# Altium schematic sheet CPU_USB2_USB3_PHY.SchDoc
size A3; SheetNumber: 9; SheetTotal: 21
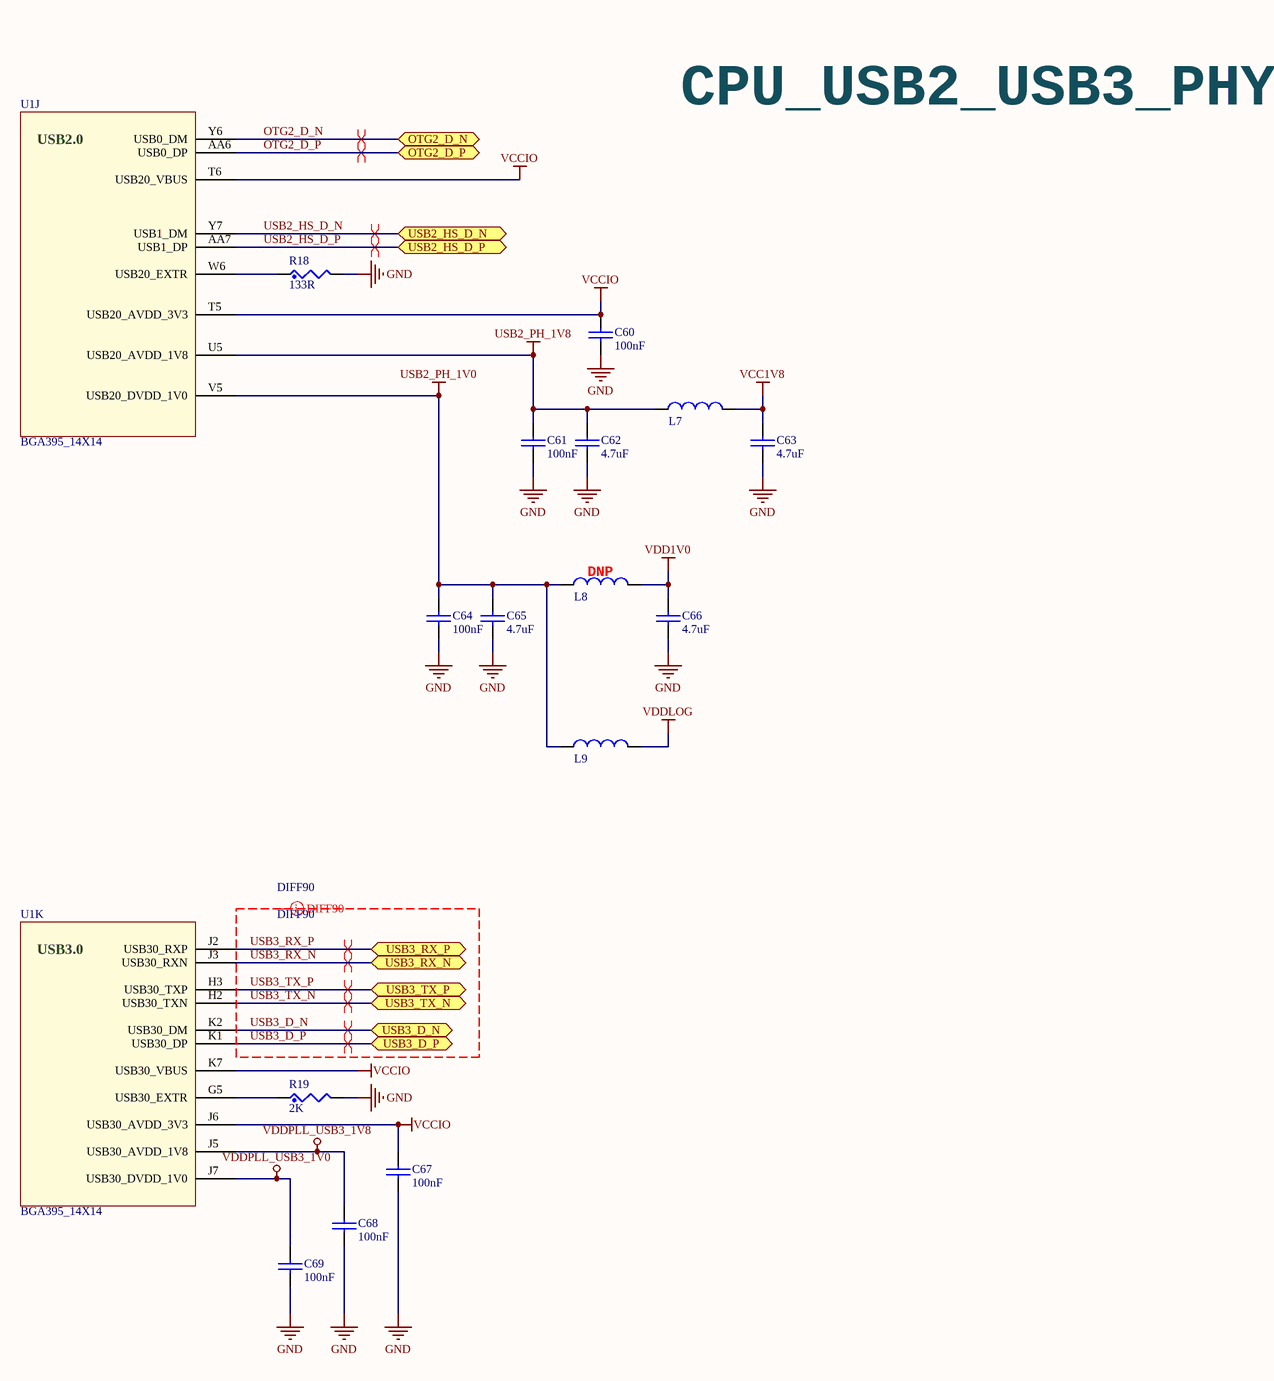
[diagram p0: CPU_USB2_USB3_PHY.SchDoc]

## Parts
C60  100nF  [0402_CC - C]
C61  100nF  [0402_CC - C]
C62  4.7uF  [0402_CC - C]
C63  4.7uF  [0402_CC - C]
C64  100nF  [0402_CC - C]
C65  4.7uF  [0402_CC - C]
C66  4.7uF  [0402_CC - C]
C67  100nF  [0402_CC - C]
C68  100nF  [0402_CC - C]
C69  100nF  [0402_CC - C]
L7  INDCHIP  [0603_C_Inductor]  (value not drawn)
L8  INDCHIP  [0603_C_Inductor]  (value not drawn)
L9  INDCHIP  [0603_C_Inductor]  (value not drawn)
R18  133R  [0402_CR]
R19  2K  [0402_CR]
U1  BGA395_14X14  [BGA395C65P21X21_1750X1750X117]  (parts J,K of 17)

## Ports
OTG2_D_N (bidir), OTG2_D_P (bidir), USB2_HS_D_N (bidir), USB2_HS_D_P (bidir), USB3_D_N (bidir), USB3_D_P (bidir), USB3_RX_N (bidir), USB3_RX_P (bidir), USB3_TX_N (bidir), USB3_TX_P (bidir)

## Nets
GND: C60.2 C61.2 C62.2 C63.2 C64.2 C65.2 C66.2 C67.2 C68.2 C69.2 R18.2 R19.2
USB2_PH_1V0: C64.1 C65.1 L8.1 L9.1 U1.V5(USB20_DVDD_1V0)
USB2_PH_1V8: C61.1 C62.1 L7.1 U1.U5(USB20_AVDD_1V8)
VCC1V8: C63.1 L7.2
VCCIO: C60.1 C67.1 U1.J6(USB30_AVDD_3V3) U1.K7(USB30_VBUS) U1.T5(USB20_AVDD_3V3) U1.T6(USB20_VBUS)
VDD1V0: C66.1 L8.2
VDDLOG: L9.2
VDDPLL_USB3_1V0: C69.1 U1.J7(USB30_DVDD_1V0)
VDDPLL_USB3_1V8: C68.1 U1.J5(USB30_AVDD_1V8)
OTG2_D_N: U1.Y6(USB0_DM) ; port OTG2_D_N
OTG2_D_P: U1.AA6(USB0_DP) ; port OTG2_D_P
USB2_HS_D_N: U1.Y7(USB1_DM) ; port USB2_HS_D_N
USB2_HS_D_P: U1.AA7(USB1_DP) ; port USB2_HS_D_P
USB3_D_N: U1.K2(USB30_DM) ; port USB3_D_N
USB3_D_P: U1.K1(USB30_DP) ; port USB3_D_P
USB3_RX_N: U1.J3(USB30_RXN) ; port USB3_RX_N
USB3_RX_P: U1.J2(USB30_RXP) ; port USB3_RX_P
USB3_TX_N: U1.H2(USB30_TXN) ; port USB3_TX_N
USB3_TX_P: U1.H3(USB30_TXP) ; port USB3_TX_P
NetR18_1: R18.1 U1.W6(USB20_EXTR)
NetR19_1: R19.1 U1.G5(USB30_EXTR)

## Layout directives
differential pair: OTG2_D_N, OTG2_D_P, USB2_HS_D_N, USB2_HS_D_P, USB3_D_N, USB3_D_P, USB3_RX_N, USB3_RX_P, USB3_TX_N, USB3_TX_P
differential pair; differential pair class DIFF90; net class DIFF90: USB3_D_N, USB3_D_P, USB3_RX_N, USB3_RX_P, USB3_TX_N, USB3_TX_P

## Notes on the sheet
- CPU_USB2_USB3_PHY
- (near L8) DNP
- (in symbol RK3328, part J) USB2.0
- (in symbol RK3328, part K) USB3.0

## Library data of the parts
C60-C69 = CAP_NP: CLASS: DISCRETE
L7-L9 = INDCHIP: Fixed Inductors  TDK, By AAR
R18 R19 = RES: CLASS: DISCRETE
U1 = RK3328: By AAR